# Altium schematic sheet 3_STM32KIT_Power.SchDoc
size A; SheetNumber: 2; SheetTotal: 4; SPICEModelCacheICPTIIAS: <root> / <DocumentId>ICPTIIAS</DocumentId> / </root>
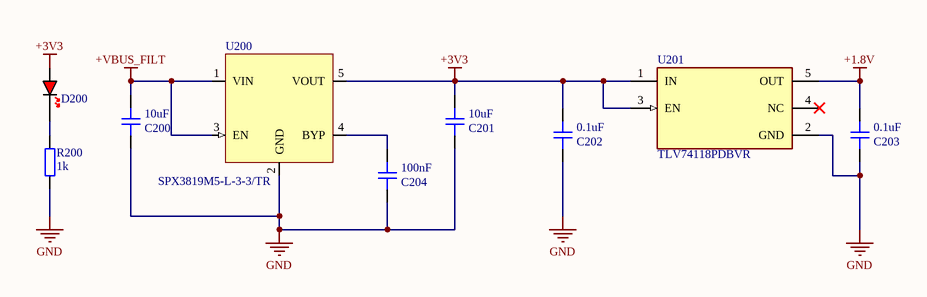
[diagram p0: 3_STM32KIT_Power.SchDoc]

## Parts
C200  10uF  [CAP_0402]
C201  10uF  [CAP_0402]
C202  0.1uF  [CAP_0402]
C203  0.1uF  [CAP_0402]
C204  100nF  [CAP_0402]
D200  RED  [LED_0402_RED]  (value not drawn)
R200  1k  [RES_0402]
U200  SPX3819M5-L-3-3/TR  [SOT-23-5]
U201  TLV74118PDBVR  [FP-DBV0005A-IPC_C]

## Nets
+1.8V: C203.2 U201.5(OUT)
+3V3: C201.2 C202.2 D200.A U200.5(VOUT) U201.1(IN) U201.3(EN)
+VBUS_FILT: C200.2 U200.1(VIN) U200.3(EN)
GND: C200.1 C201.1 C202.1 C203.1 C204.1 R200.1 U200.2(GND) U201.2(GND)
NetC204_2: C204.2 U200.4(BYP)
NetD200_K: D200.K R200.2

Not connected (* = marked no-connect by the designer): U201 4(NC)*

## Library data of the parts
C200-C204 = CMP-001-00086-1: Capacitor SMD 0402; Manufacturer: *; Distributor Link: *; Manufacturer Part Number: *; Design Item ID: CAP_0402; Dielectric: *; LCSC: *; Source: Schematic-Lib-PhilsLab.SchLib; Rating: *
D200 = LED_0402_RED: LED 0402 RED SMD
R200 = RES_0402: Resistor SMD 0402; Manufacturer: *; Manufacturer Part Number: *; Distributor Link: *; LCSC: *
U200 = CMP-028-000131-1: 500mA +3.3V Low-Noise LDO Voltage Regulator; Manufacturer: MaxLinear; Source: Schematic-Lib-PhilsLab.SchLib; Design Item ID: SPX3819M5-L-3-3/TR; Manufacturer Part Number: SPX3819M5-L-3-3/TR
U201 = CMP-04917-000111-2: None; Output Configuration: Positive; Number of Regulators: 1; Quiescent Current: 50uA; Max Input Voltage: 5.5V; Dropout Voltage: 695mV; Output Type: Fixed; Power Supply Rejection Ratio (PSRR): 55dB; Max Supply Current: 75uA; Output Current: 150mA; Min Output Voltage: 1.8V; Packaging: Cut Tape; Mount: Surface Mount; Max Operating Temperature: 125°C; Case/Package: SOT-23-5; RoHS Compliant: Yes; Min Operating Temperature: -40°C